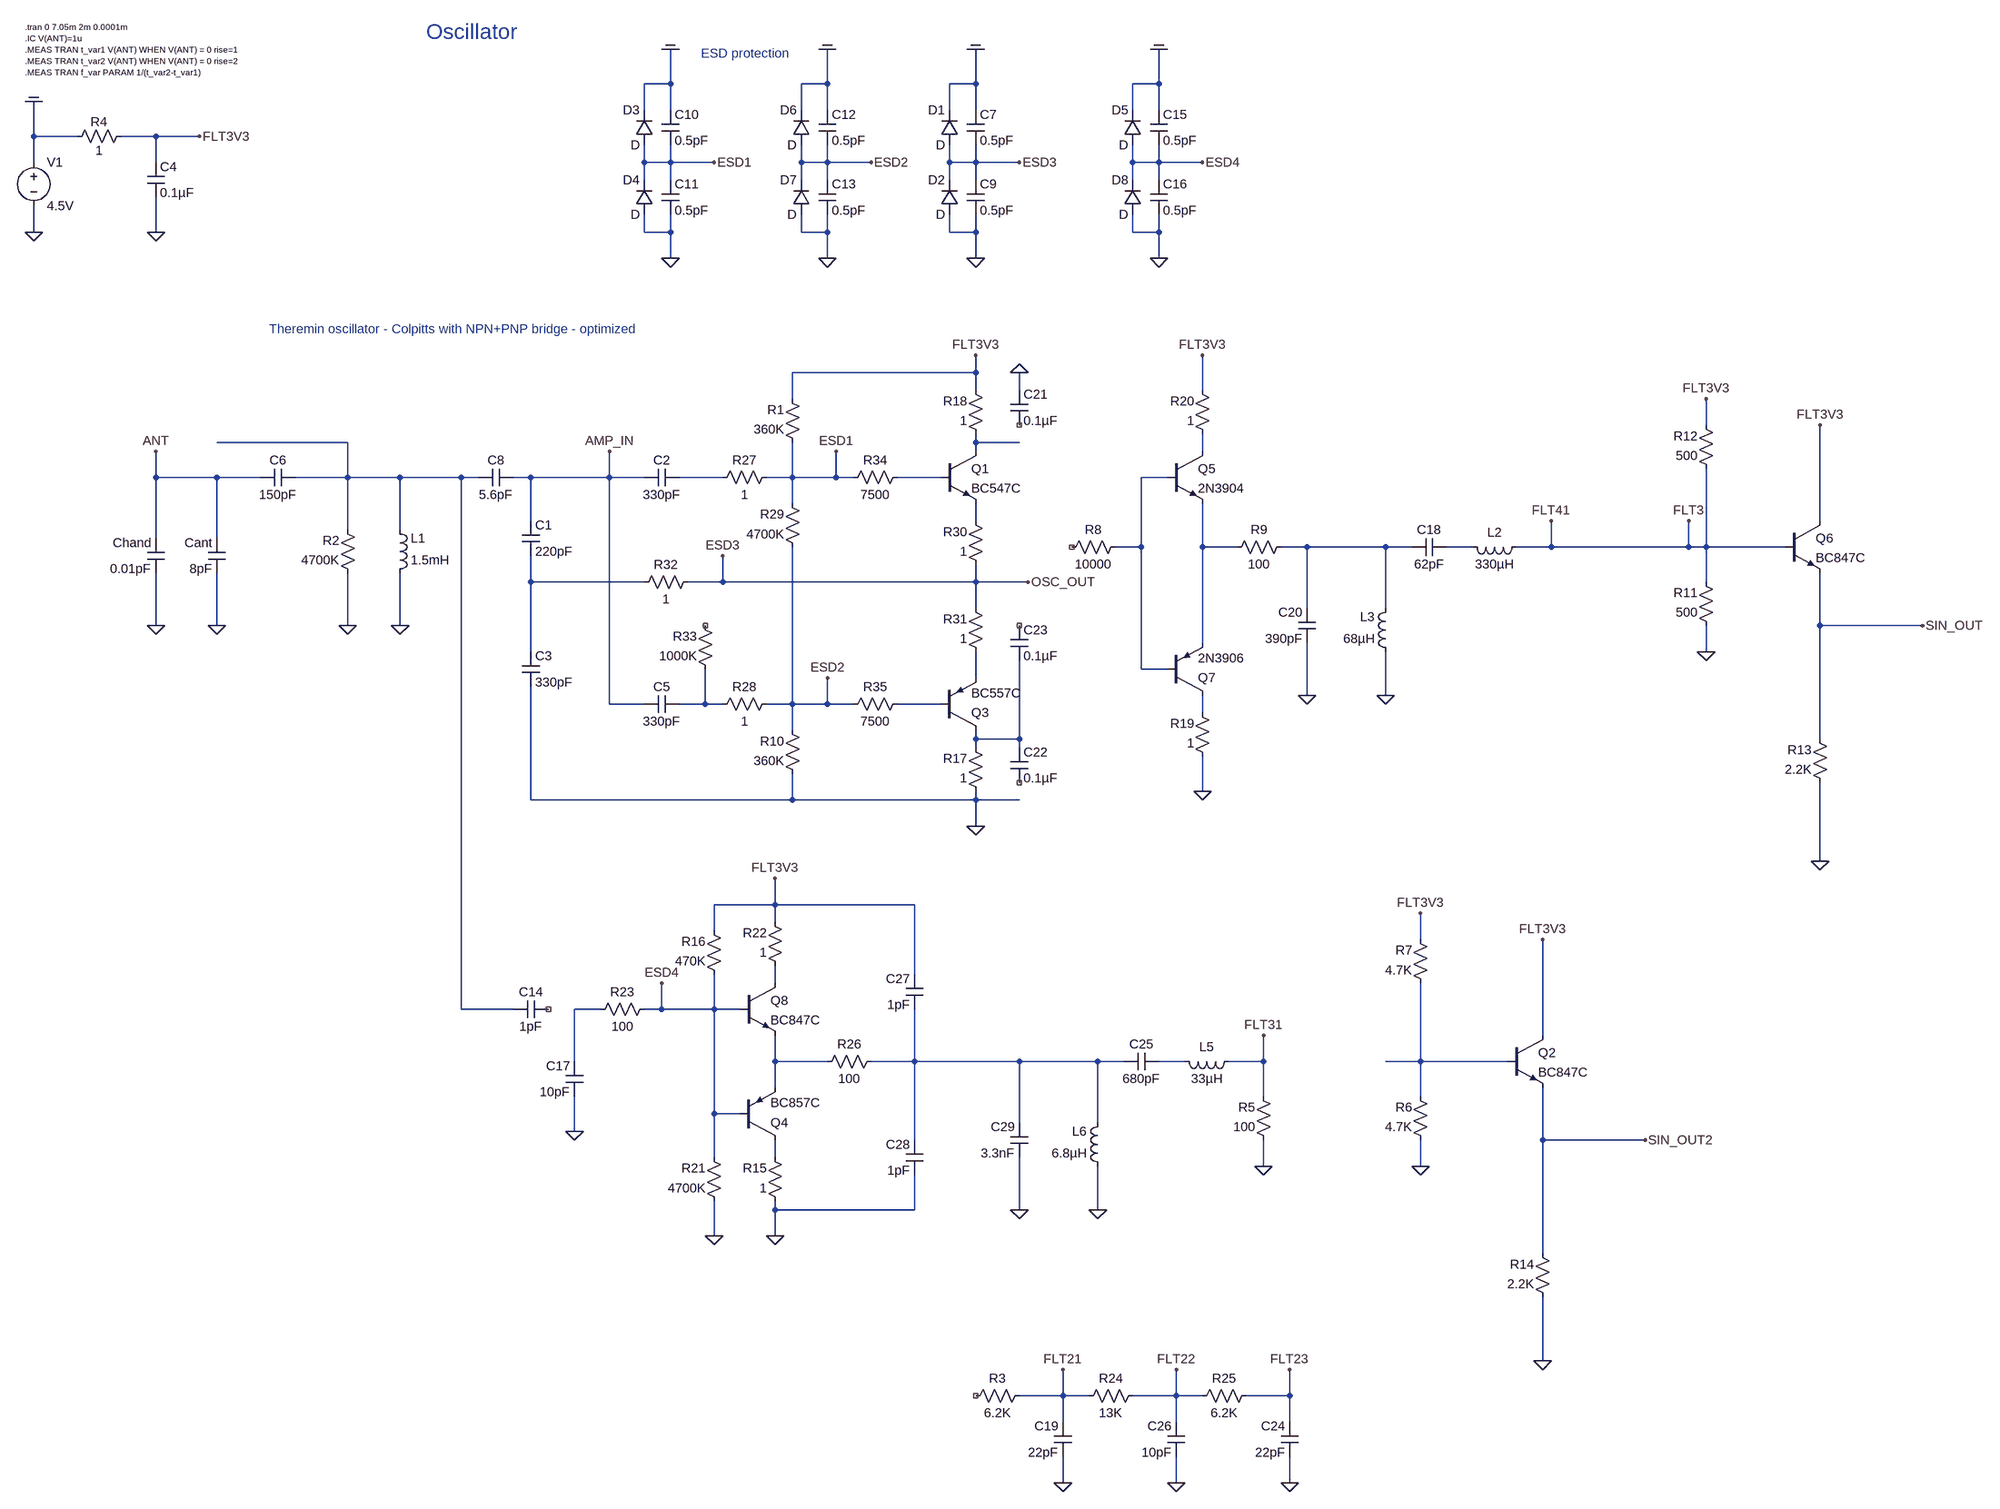
[diagram p0: schematic 2020_npn_pnp_advanced_osc_sine_out_v7.asc]
2020_npn_pnp_advanced_osc_sine_out_v7.asc, the LTspice schematic file:
Version 4
SHEET 1 3876 2724
WIRE 176 -96 176 -160
WIRE 176 -96 128 -96
WIRE 464 -96 464 -160
WIRE 464 -96 416 -96
WIRE 736 -96 736 -160
WIRE 736 -96 688 -96
WIRE 1072 -96 1072 -160
WIRE 1072 -96 1024 -96
WIRE 128 -48 128 -96
WIRE 176 -48 176 -96
WIRE 416 -48 416 -96
WIRE 464 -48 464 -96
WIRE 688 -48 688 -96
WIRE 736 -48 736 -96
WIRE 1024 -48 1024 -96
WIRE 1072 -48 1072 -96
WIRE -992 0 -992 -64
WIRE -912 0 -992 0
WIRE -768 0 -832 0
WIRE -688 0 -768 0
WIRE -992 48 -992 0
WIRE -768 48 -768 0
WIRE 128 48 128 16
WIRE 176 48 176 16
WIRE 176 48 128 48
WIRE 256 48 176 48
WIRE 416 48 416 16
WIRE 464 48 464 16
WIRE 464 48 416 48
WIRE 544 48 464 48
WIRE 688 48 688 16
WIRE 736 48 736 16
WIRE 736 48 688 48
WIRE 816 48 736 48
WIRE 1024 48 1024 16
WIRE 1072 48 1072 16
WIRE 1072 48 1024 48
WIRE 1152 48 1072 48
WIRE 128 80 128 48
WIRE 176 80 176 48
WIRE 416 80 416 48
WIRE 464 80 464 48
WIRE 688 80 688 48
WIRE 736 80 736 48
WIRE 1024 80 1024 48
WIRE 1072 80 1072 48
WIRE -992 176 -992 128
WIRE -768 176 -768 112
WIRE 128 176 128 144
WIRE 176 176 176 144
WIRE 176 176 128 176
WIRE 416 176 416 144
WIRE 464 176 464 144
WIRE 464 176 416 176
WIRE 688 176 688 144
WIRE 736 176 736 144
WIRE 736 176 688 176
WIRE 1024 176 1024 144
WIRE 1072 176 1072 144
WIRE 1072 176 1024 176
WIRE 176 224 176 176
WIRE 464 224 464 176
WIRE 736 224 736 176
WIRE 1072 224 1072 176
WIRE 736 464 736 432
WIRE 736 464 400 464
WIRE 736 496 736 464
WIRE 816 496 816 464
WIRE 1152 496 1152 432
WIRE 400 512 400 464
WIRE 2096 560 2096 512
WIRE -416 592 -656 592
WIRE 736 592 736 576
WIRE 816 592 736 592
WIRE 736 608 736 592
WIRE 1152 608 1152 576
WIRE -768 656 -768 608
WIRE -656 656 -768 656
WIRE -576 656 -656 656
WIRE -416 656 -416 592
WIRE -416 656 -512 656
WIRE -320 656 -416 656
WIRE -208 656 -320 656
WIRE -176 656 -208 656
WIRE -80 656 -112 656
WIRE 64 656 64 608
WIRE 64 656 -80 656
WIRE 128 656 64 656
WIRE 272 656 192 656
WIRE 400 656 400 592
WIRE 400 656 352 656
WIRE 480 656 480 608
WIRE 480 656 400 656
WIRE 512 656 480 656
WIRE 672 656 592 656
WIRE 1088 656 1040 656
WIRE 400 704 400 656
WIRE -80 736 -80 656
WIRE 736 736 736 704
WIRE 2320 736 2320 560
WIRE -416 752 -416 656
WIRE -320 752 -320 656
WIRE -768 768 -768 656
WIRE -656 768 -656 656
WIRE 1040 784 1040 656
WIRE 1040 784 992 784
WIRE 1152 784 1152 704
WIRE 1216 784 1152 784
WIRE 1344 784 1296 784
WIRE 1488 784 1344 784
WIRE 1536 784 1488 784
WIRE 1648 784 1600 784
WIRE 1792 784 1792 736
WIRE 1792 784 1728 784
WIRE 2064 784 2064 736
WIRE 2064 784 1792 784
WIRE 2096 784 2096 640
WIRE 2096 784 2064 784
WIRE 2256 784 2096 784
WIRE -80 848 -80 800
WIRE 128 848 -80 848
WIRE 272 848 272 800
WIRE 272 848 208 848
WIRE 736 848 736 816
WIRE 736 848 272 848
WIRE 832 848 736 848
WIRE 2096 848 2096 784
WIRE 736 896 736 848
WIRE 1344 896 1344 784
WIRE 1488 896 1488 784
WIRE -768 928 -768 832
WIRE -656 928 -656 832
WIRE -416 928 -416 832
WIRE -320 928 -320 832
WIRE 2320 928 2320 832
WIRE 2528 928 2320 928
WIRE 1152 960 1152 784
WIRE -80 976 -80 848
WIRE 2096 976 2096 928
WIRE 1040 1008 1040 784
WIRE 1088 1008 1040 1008
WIRE 736 1024 736 976
WIRE 1344 1056 1344 960
WIRE 1488 1056 1488 976
WIRE 64 1072 64 656
WIRE 128 1072 64 1072
WIRE 240 1072 240 1008
WIRE 240 1072 192 1072
WIRE 272 1072 240 1072
WIRE 400 1072 400 784
WIRE 400 1072 352 1072
WIRE 464 1072 464 1024
WIRE 464 1072 400 1072
WIRE 512 1072 464 1072
WIRE 672 1072 592 1072
WIRE 1152 1088 1152 1056
WIRE 400 1120 400 1072
WIRE 736 1136 736 1120
WIRE 816 1136 816 992
WIRE 816 1136 736 1136
WIRE 2320 1136 2320 928
WIRE 736 1152 736 1136
WIRE 816 1152 816 1136
WIRE 1152 1232 1152 1168
WIRE -80 1248 -80 1040
WIRE 400 1248 400 1200
WIRE 400 1248 -80 1248
WIRE 736 1248 736 1232
WIRE 736 1248 400 1248
WIRE 816 1248 736 1248
WIRE 736 1296 736 1248
WIRE 2320 1360 2320 1216
WIRE 368 1440 368 1392
WIRE 368 1440 256 1440
WIRE 624 1440 368 1440
WIRE 368 1472 368 1440
WIRE 256 1488 256 1440
WIRE 1552 1504 1552 1456
WIRE 624 1568 624 1440
WIRE 368 1584 368 1552
WIRE -208 1632 -208 656
WIRE -112 1632 -208 1632
WIRE 48 1632 0 1632
WIRE 160 1632 160 1584
WIRE 160 1632 128 1632
WIRE 256 1632 256 1568
WIRE 256 1632 160 1632
WIRE 304 1632 256 1632
WIRE 1776 1680 1776 1504
WIRE 0 1728 0 1632
WIRE 368 1728 368 1680
WIRE 464 1728 368 1728
WIRE 624 1728 624 1632
WIRE 624 1728 544 1728
WIRE 816 1728 624 1728
WIRE 960 1728 816 1728
WIRE 1008 1728 960 1728
WIRE 1120 1728 1072 1728
WIRE 1264 1728 1264 1680
WIRE 1264 1728 1200 1728
WIRE 1552 1728 1552 1584
WIRE 1552 1728 1488 1728
WIRE 1712 1728 1552 1728
WIRE 368 1776 368 1728
WIRE 1264 1792 1264 1728
WIRE 1552 1792 1552 1728
WIRE 256 1824 256 1632
WIRE 304 1824 256 1824
WIRE 816 1840 816 1728
WIRE 960 1840 960 1728
WIRE 0 1856 0 1792
WIRE 624 1872 624 1728
WIRE 1776 1872 1776 1776
WIRE 1984 1872 1776 1872
WIRE 256 1904 256 1824
WIRE 368 1904 368 1872
WIRE 1264 1920 1264 1872
WIRE 1552 1920 1552 1872
WIRE 368 2000 368 1984
WIRE 624 2000 624 1936
WIRE 624 2000 368 2000
WIRE 816 2000 816 1904
WIRE 960 2000 960 1920
WIRE 256 2048 256 1984
WIRE 368 2048 368 2000
WIRE 1776 2080 1776 1872
WIRE 1776 2304 1776 2160
WIRE 896 2368 896 2320
WIRE 896 2368 816 2368
WIRE 944 2368 896 2368
WIRE 1104 2368 1104 2320
WIRE 1104 2368 1024 2368
WIRE 1152 2368 1104 2368
WIRE 1312 2368 1312 2320
WIRE 1312 2368 1232 2368
WIRE 896 2416 896 2368
WIRE 1104 2416 1104 2368
WIRE 1312 2416 1312 2368
WIRE 896 2528 896 2480
WIRE 1104 2528 1104 2480
WIRE 1312 2528 1312 2480
FLAG -992 176 0
FLAG -768 928 0
FLAG -768 608 ANT
FLAG -992 -64 COM
FLAG 176 224 0
FLAG 176 -160 COM
FLAG 256 48 ESD1
FLAG 464 224 0
FLAG 464 -160 COM
FLAG 544 48 ESD2
FLAG -656 928 0
FLAG 480 608 ESD1
FLAG -768 176 0
FLAG -416 928 0
FLAG -320 928 0
FLAG -688 0 FLT3V3
FLAG 736 432 FLT3V3
FLAG 832 848 OSC_OUT
FLAG 736 1296 0
FLAG 464 1024 ESD2
FLAG 736 224 0
FLAG 736 -160 COM
FLAG 816 48 ESD3
FLAG 272 800 ESD3
FLAG 64 608 AMP_IN
FLAG 1072 224 0
FLAG 1072 -160 COM
FLAG 1152 48 ESD4
FLAG 160 1584 ESD4
FLAG 0 1856 0
FLAG 368 1392 FLT3V3
FLAG 2064 736 FLT3
FLAG 2096 976 0
FLAG 2320 560 FLT3V3
FLAG 2320 1360 0
FLAG 2528 928 SIN_OUT
FLAG 1152 432 FLT3V3
FLAG 1152 1232 0
FLAG 2096 512 FLT3V3
FLAG 896 2320 FLT21
FLAG 896 2528 0
FLAG 1552 1920 0
FLAG 1776 1504 FLT3V3
FLAG 1776 2304 0
FLAG 1984 1872 SIN_OUT2
FLAG 1552 1456 FLT3V3
FLAG 368 2048 0
FLAG 256 2048 0
FLAG 1104 2528 0
FLAG 1104 2320 FLT22
FLAG 1312 2528 0
FLAG 1312 2320 FLT23
FLAG 1264 1680 FLT31
FLAG 1264 1920 0
FLAG 960 2000 0
FLAG 816 2000 0
FLAG 1792 736 FLT41
FLAG 1488 1056 0
FLAG 1344 1056 0
FLAG 816 464 0
SYMBOL voltage -992 32 R0
WINDOW 123 0 0 Left 2
WINDOW 39 0 0 Left 2
SYMATTR InstName V1
SYMATTR Value 4.5V
SYMBOL ind -336 848 M180
WINDOW 0 36 80 Left 2
WINDOW 3 36 40 Left 2
SYMATTR InstName L1
SYMATTR Value 1.5mH
SYMATTR SpiceLine Ipk=0.1 Rser=82 Rpar=20Meg Cpar=1.286pF
SYMBOL cap -752 768 M0
SYMATTR InstName Chand
SYMATTR Value 0.01pF
SYMBOL diode 144 16 R180
WINDOW 0 24 64 Left 2
WINDOW 3 24 0 Left 2
SYMATTR InstName D3
SYMBOL diode 144 144 R180
WINDOW 0 24 64 Left 2
WINDOW 3 24 0 Left 2
SYMATTR InstName D4
SYMBOL cap 160 -48 R0
SYMATTR InstName C10
SYMATTR Value 0.5pF
SYMBOL cap 160 80 R0
SYMATTR InstName C11
SYMATTR Value 0.5pF
SYMBOL diode 432 16 R180
WINDOW 0 24 64 Left 2
WINDOW 3 24 0 Left 2
SYMATTR InstName D6
SYMBOL diode 432 144 R180
WINDOW 0 24 64 Left 2
WINDOW 3 24 0 Left 2
SYMATTR InstName D7
SYMBOL cap 448 -48 R0
SYMATTR InstName C12
SYMATTR Value 0.5pF
SYMBOL cap 448 80 R0
SYMATTR InstName C13
SYMATTR Value 0.5pF
SYMBOL cap -640 768 M0
SYMATTR InstName Cant
SYMATTR Value 8pF
SYMBOL res -816 -16 R90
WINDOW 0 5 56 VBottom 2
WINDOW 3 27 56 VTop 2
SYMATTR InstName R4
SYMATTR Value 1
SYMBOL cap -784 48 R0
SYMATTR InstName C4
SYMATTR Value 0.1µF
SYMBOL res 416 608 R180
WINDOW 0 31 76 Left 2
WINDOW 3 31 40 Left 2
SYMATTR InstName R1
SYMATTR Value 360K
SYMBOL res -400 848 R180
WINDOW 0 31 76 Left 2
WINDOW 3 31 40 Left 2
SYMATTR InstName R2
SYMATTR Value 4700K
SYMBOL cap -96 736 R0
SYMATTR InstName C1
SYMATTR Value 220pF
SYMBOL cap -96 976 R0
SYMATTR InstName C3
SYMATTR Value 330pF
SYMBOL npn 672 608 R0
SYMATTR InstName Q1
SYMATTR Value BC547C
SYMBOL cap -112 640 R90
WINDOW 0 0 32 VBottom 2
WINDOW 3 32 32 VTop 2
SYMATTR InstName C8
SYMATTR Value 5.6pF
SYMBOL pnp 672 1120 M180
SYMATTR InstName Q3
SYMATTR Value BC557C
SYMBOL res 416 1216 R180
WINDOW 0 31 76 Left 2
WINDOW 3 31 40 Left 2
SYMATTR InstName R10
SYMATTR Value 360K
SYMBOL cap 192 640 R90
WINDOW 0 0 32 VBottom 2
WINDOW 3 32 32 VTop 2
SYMATTR InstName C2
SYMATTR Value 330pF
SYMBOL cap 192 1056 R90
WINDOW 0 0 32 VBottom 2
WINDOW 3 32 32 VTop 2
SYMATTR InstName C5
SYMATTR Value 330pF
SYMBOL cap -512 640 R90
WINDOW 0 0 32 VBottom 2
WINDOW 3 32 32 VTop 2
SYMATTR InstName C6
SYMATTR Value 150pF
SYMBOL diode 704 16 R180
WINDOW 0 24 64 Left 2
WINDOW 3 24 0 Left 2
SYMATTR InstName D1
SYMBOL diode 704 144 R180
WINDOW 0 24 64 Left 2
WINDOW 3 24 0 Left 2
SYMATTR InstName D2
SYMBOL cap 720 -48 R0
SYMATTR InstName C7
SYMATTR Value 0.5pF
SYMBOL cap 720 80 R0
SYMATTR InstName C9
SYMATTR Value 0.5pF
SYMBOL cap -48 1616 R90
WINDOW 0 0 32 VBottom 2
WINDOW 3 32 32 VTop 2
SYMATTR InstName C14
SYMATTR Value 1pF
SYMBOL diode 1040 16 R180
WINDOW 0 24 64 Left 2
WINDOW 3 24 0 Left 2
SYMATTR InstName D5
SYMBOL diode 1040 144 R180
WINDOW 0 24 64 Left 2
WINDOW 3 24 0 Left 2
SYMATTR InstName D8
SYMBOL cap 1056 -48 R0
SYMATTR InstName C15
SYMATTR Value 0.5pF
SYMBOL cap 1056 80 R0
SYMATTR InstName C16
SYMATTR Value 0.5pF
SYMBOL cap 16 1792 R180
WINDOW 0 24 56 Left 2
WINDOW 3 24 8 Left 2
SYMATTR InstName C17
SYMATTR Value 10pF
SYMBOL npn 304 1584 R0
SYMATTR InstName Q8
SYMATTR Value BC847C
SYMBOL res 2112 944 R180
WINDOW 0 31 76 Left 2
WINDOW 3 31 40 Left 2
SYMATTR InstName R11
SYMATTR Value 500
SYMBOL npn 2256 736 R0
SYMATTR InstName Q6
SYMATTR Value BC847C
SYMBOL res 2112 656 R180
WINDOW 0 31 76 Left 2
WINDOW 3 31 40 Left 2
SYMATTR InstName R12
SYMATTR Value 500
SYMBOL res 2336 1232 R180
WINDOW 0 31 76 Left 2
WINDOW 3 31 40 Left 2
SYMATTR InstName R13
SYMATTR Value 2.2K
SYMBOL res 752 1248 R180
WINDOW 0 31 76 Left 2
WINDOW 3 31 40 Left 2
SYMATTR InstName R17
SYMATTR Value 1
SYMBOL res 752 592 R180
WINDOW 0 31 76 Left 2
WINDOW 3 31 40 Left 2
SYMATTR InstName R18
SYMATTR Value 1
SYMBOL npn 1088 608 R0
SYMATTR InstName Q5
SYMATTR Value 2N3904
SYMBOL pnp 1088 1056 M180
SYMATTR InstName Q7
SYMATTR Value 2N3906
SYMBOL res 1168 1184 R180
WINDOW 0 31 76 Left 2
WINDOW 3 31 40 Left 2
SYMATTR InstName R19
SYMATTR Value 1
SYMBOL res 1168 592 R180
WINDOW 0 31 76 Left 2
WINDOW 3 31 40 Left 2
SYMATTR InstName R20
SYMATTR Value 1
SYMBOL cap 912 2480 R180
WINDOW 0 24 56 Left 2
WINDOW 3 24 8 Left 2
SYMATTR InstName C19
SYMATTR Value 22pF
SYMBOL res 720 2384 R270
WINDOW 0 32 56 VTop 2
WINDOW 3 0 56 VBottom 2
SYMATTR InstName R3
SYMATTR Value 6.2K
SYMBOL res 1568 1888 R180
WINDOW 0 31 76 Left 2
WINDOW 3 31 40 Left 2
SYMATTR InstName R6
SYMATTR Value 4.7K
SYMBOL npn 1712 1680 R0
SYMATTR InstName Q2
SYMATTR Value BC847C
SYMBOL res 1568 1600 R180
WINDOW 0 31 76 Left 2
WINDOW 3 31 40 Left 2
SYMATTR InstName R7
SYMATTR Value 4.7K
SYMBOL res 1792 2176 R180
WINDOW 0 31 76 Left 2
WINDOW 3 31 40 Left 2
SYMATTR InstName R14
SYMATTR Value 2.2K
SYMBOL res 272 1584 R180
WINDOW 0 31 76 Left 2
WINDOW 3 31 40 Left 2
SYMATTR InstName R16
SYMATTR Value 470K
SYMBOL res 384 1568 R180
WINDOW 0 31 76 Left 2
WINDOW 3 31 40 Left 2
SYMATTR InstName R22
SYMATTR Value 1
SYMBOL res 32 1648 R270
WINDOW 0 32 56 VTop 2
WINDOW 3 0 56 VBottom 2
SYMATTR InstName R23
SYMATTR Value 100
SYMBOL pnp 304 1872 M180
SYMATTR InstName Q4
SYMATTR Value BC857C
SYMBOL res 384 2000 R180
WINDOW 0 31 76 Left 2
WINDOW 3 31 40 Left 2
SYMATTR InstName R15
SYMATTR Value 1
SYMBOL res 272 2000 R180
WINDOW 0 31 76 Left 2
WINDOW 3 31 40 Left 2
SYMATTR InstName R21
SYMATTR Value 4700K
SYMBOL cap 1120 2480 R180
WINDOW 0 24 56 Left 2
WINDOW 3 24 8 Left 2
SYMATTR InstName C26
SYMATTR Value 10pF
SYMBOL res 928 2384 R270
WINDOW 0 32 56 VTop 2
WINDOW 3 0 56 VBottom 2
SYMATTR InstName R24
SYMATTR Value 13K
SYMBOL cap 1328 2480 R180
WINDOW 0 24 56 Left 2
WINDOW 3 24 8 Left 2
SYMATTR InstName C24
SYMATTR Value 22pF
SYMBOL res 1136 2384 R270
WINDOW 0 32 56 VTop 2
WINDOW 3 0 56 VBottom 2
SYMATTR InstName R25
SYMATTR Value 6.2K
SYMBOL ind 1216 1712 R90
WINDOW 0 5 56 VBottom 2
WINDOW 3 32 56 VTop 2
SYMATTR InstName L5
SYMATTR Value 33µH
SYMBOL cap 1072 1712 R90
WINDOW 0 0 32 VBottom 2
WINDOW 3 32 32 VTop 2
SYMATTR InstName C25
SYMATTR Value 680pF
SYMBOL res 1280 1888 R180
WINDOW 0 31 76 Left 2
WINDOW 3 31 40 Left 2
SYMATTR InstName R5
SYMATTR Value 100
SYMBOL cap 640 1632 R180
WINDOW 0 24 56 Left 2
WINDOW 3 24 8 Left 2
SYMATTR InstName C27
SYMATTR Value 1pF
SYMBOL cap 640 1936 R180
WINDOW 0 24 56 Left 2
WINDOW 3 24 8 Left 2
SYMATTR InstName C28
SYMATTR Value 1pF
SYMBOL res 448 1744 R270
WINDOW 0 32 56 VTop 2
WINDOW 3 0 56 VBottom 2
SYMATTR InstName R26
SYMATTR Value 100
SYMBOL cap 832 1904 R180
WINDOW 0 24 56 Left 2
WINDOW 3 24 8 Left 2
SYMATTR InstName C29
SYMATTR Value 3.3nF
SYMBOL ind 976 1936 R180
WINDOW 0 36 80 Left 2
WINDOW 3 36 40 Left 2
SYMATTR InstName L6
SYMATTR Value 6.8µH
SYMBOL ind 1744 768 R90
WINDOW 0 5 56 VBottom 2
WINDOW 3 32 56 VTop 2
SYMATTR InstName L2
SYMATTR Value 330µH
SYMBOL cap 1600 768 R90
WINDOW 0 0 32 VBottom 2
WINDOW 3 32 32 VTop 2
SYMATTR InstName C18
SYMATTR Value 62pF
SYMBOL cap 1360 960 R180
WINDOW 0 24 56 Left 2
WINDOW 3 24 8 Left 2
SYMATTR InstName C20
SYMATTR Value 390pF
SYMBOL ind 1504 992 R180
WINDOW 0 36 80 Left 2
WINDOW 3 36 40 Left 2
SYMATTR InstName L3
SYMATTR Value 68µH
SYMBOL res 1200 800 R270
WINDOW 0 32 56 VTop 2
WINDOW 3 0 56 VBottom 2
SYMATTR InstName R9
SYMATTR Value 100
SYMBOL res 896 800 R270
WINDOW 0 32 56 VTop 2
WINDOW 3 0 56 VBottom 2
SYMATTR InstName R8
SYMATTR Value 10000
SYMBOL res 256 672 R270
WINDOW 0 32 56 VTop 2
WINDOW 3 0 56 VBottom 2
SYMATTR InstName R27
SYMATTR Value 1
SYMBOL res 256 1088 R270
WINDOW 0 32 56 VTop 2
WINDOW 3 0 56 VBottom 2
SYMATTR InstName R28
SYMATTR Value 1
SYMBOL res 416 800 R180
WINDOW 0 31 76 Left 2
WINDOW 3 31 40 Left 2
SYMATTR InstName R29
SYMATTR Value 4700K
SYMBOL res 752 832 R180
WINDOW 0 31 76 Left 2
WINDOW 3 31 40 Left 2
SYMATTR InstName R30
SYMATTR Value 1
SYMBOL res 752 992 R180
WINDOW 0 31 76 Left 2
WINDOW 3 31 40 Left 2
SYMATTR InstName R31
SYMATTR Value 1
SYMBOL res 112 864 R270
WINDOW 0 32 56 VTop 2
WINDOW 3 0 56 VBottom 2
SYMATTR InstName R32
SYMATTR Value 1
SYMBOL res 256 1024 R180
WINDOW 0 31 76 Left 2
WINDOW 3 31 40 Left 2
SYMATTR InstName R33
SYMATTR Value 1000K
SYMBOL cap 800 496 R0
SYMATTR InstName C21
SYMATTR Value 0.1µF
SYMBOL cap 800 1152 R0
SYMATTR InstName C22
SYMATTR Value 0.1µF
SYMBOL cap 800 928 R0
SYMATTR InstName C23
SYMATTR Value 0.1µF
SYMBOL res 496 672 R270
WINDOW 0 32 56 VTop 2
WINDOW 3 0 56 VBottom 2
SYMATTR InstName R34
SYMATTR Value 7500
SYMBOL res 496 1088 R270
WINDOW 0 32 56 VTop 2
WINDOW 3 0 56 VBottom 2
SYMATTR InstName R35
SYMATTR Value 7500
TEXT -1008 -200 Left 1 !.tran 0 7.05m 2m 0.0001m\n.IC V(ANT)=1u\n.MEAS TRAN t_var1 V(ANT) WHEN V(ANT) = 0 rise=1\n.MEAS TRAN t_var2 V(ANT) WHEN V(ANT) = 0 rise=2\n.MEAS TRAN f_var PARAM 1/(t_var2-t_var1)
TEXT 232 -152 Left 2 ;ESD protection
TEXT -272 -192 Left 4 ;Oscillator
TEXT -560 384 Left 2 ;Theremin oscillator - Colpitts with NPN+PNP bridge - optimized

The netlist it stands for:
* 2020_npn_pnp_advanced_osc_sine_out_v7.asc
V1 COM 0 4.5V
L1 0 N001 1.5mH Ipk=0.1 Rser=82 Rpar=20Meg Cpar=1.286pF
Chand ANT 0 0.01pF
D3 ESD1 COM D
D4 0 ESD1 D
C10 COM ESD1 0.5pF
C11 ESD1 0 0.5pF
D6 ESD2 COM D
D7 0 ESD2 D
C12 COM ESD2 0.5pF
C13 ESD2 0 0.5pF
Cant ANT 0 8pF
R4 FLT3V3 COM 1
C4 FLT3V3 0 0.1µF
R1 ESD1 FLT3V3 360K
R2 0 N001 4700K
C1 AMP_IN N011 220pF
C3 N011 0 330pF
Q1 N002 N005 N007 0 BC547C
C8 AMP_IN N001 5.6pF
Q3 N016 N014 N012 0 BC557C
R10 0 ESD2 360K
C2 N004 AMP_IN 330pF
C5 N013 AMP_IN 330pF
C6 N001 ANT 150pF
D1 ESD3 COM D
D2 0 ESD3 D
C7 COM ESD3 0.5pF
C9 ESD3 0 0.5pF
C14 NC_01 N001 1pF
D5 ESD4 COM D
D8 0 ESD4 D
C15 COM ESD4 0.5pF
C16 ESD4 0 0.5pF
C17 0 N018 10pF
Q8 N017 ESD4 N019 0 BC847C
R11 0 FLT41 500
Q6 FLT3V3 FLT41 SIN_OUT 0 BC847C
R12 FLT41 FLT3V3 500
R13 0 SIN_OUT 2.2K
R17 0 N016 1
R18 N002 FLT3V3 1
Q5 N003 N006 N008 0 2N3904
Q7 N015 N006 N008 0 2N3906
R19 0 N015 1
R20 N003 FLT3V3 1
C19 0 FLT21 22pF
R3 NC_02 FLT21 6.2K
R6 0 N022 4.7K
Q2 FLT3V3 N022 SIN_OUT2 0 BC847C
R7 N022 FLT3V3 4.7K
R14 0 SIN_OUT2 2.2K
R16 ESD4 FLT3V3 470K
R22 N017 FLT3V3 1
R23 N018 ESD4 100
Q4 N023 ESD4 N019 0 BC857C
R15 0 N023 1
R21 0 ESD4 4700K
C26 0 FLT22 10pF
R24 FLT21 FLT22 13K
C24 0 FLT23 22pF
R25 FLT22 FLT23 6.2K
L5 FLT31 N021 33µH
C25 N021 N020 680pF
R5 0 FLT31 100
C27 N020 FLT3V3 1pF
C28 0 N020 1pF
R26 N019 N020 100
C29 0 N020 3.3nF
L6 0 N020 6.8µH
L2 FLT41 N010 330µH
C18 N010 N009 62pF
C20 0 N009 390pF
L3 0 N009 68µH
R9 N008 N009 100
R8 NC_03 N006 10000
R27 N004 ESD1 1
R28 N013 ESD2 1
R29 ESD2 ESD1 4700K
R30 ESD3 N007 1
R31 N012 ESD3 1
R32 N011 ESD3 1
R33 N013 NC_04 1000K
C21 0 NC_05 0.1µF
C22 N016 NC_06 0.1µF
C23 NC_07 N016 0.1µF
R34 ESD1 N005 7500
R35 ESD2 N014 7500
.model D D
.lib standard.dio
.model NPN NPN
.model PNP PNP
.lib standard.bjt
.tran 0 7.05m 2m 0.0001m
.IC V(ANT)=1u
.MEAS TRAN t_var1 V(ANT) WHEN V(ANT) = 0 rise=1
.MEAS TRAN t_var2 V(ANT) WHEN V(ANT) = 0 rise=2
.MEAS TRAN f_var PARAM 1/(t_var2-t_var1)
* ESD protection
* Oscillator
* Theremin oscillator - Colpitts with NPN+PNP bridge - optimized
.backanno
.end